# EAGLE design ee242a-lab6-amp-osc (EAGLE 9.2.2)

## Sheet 1 of 2
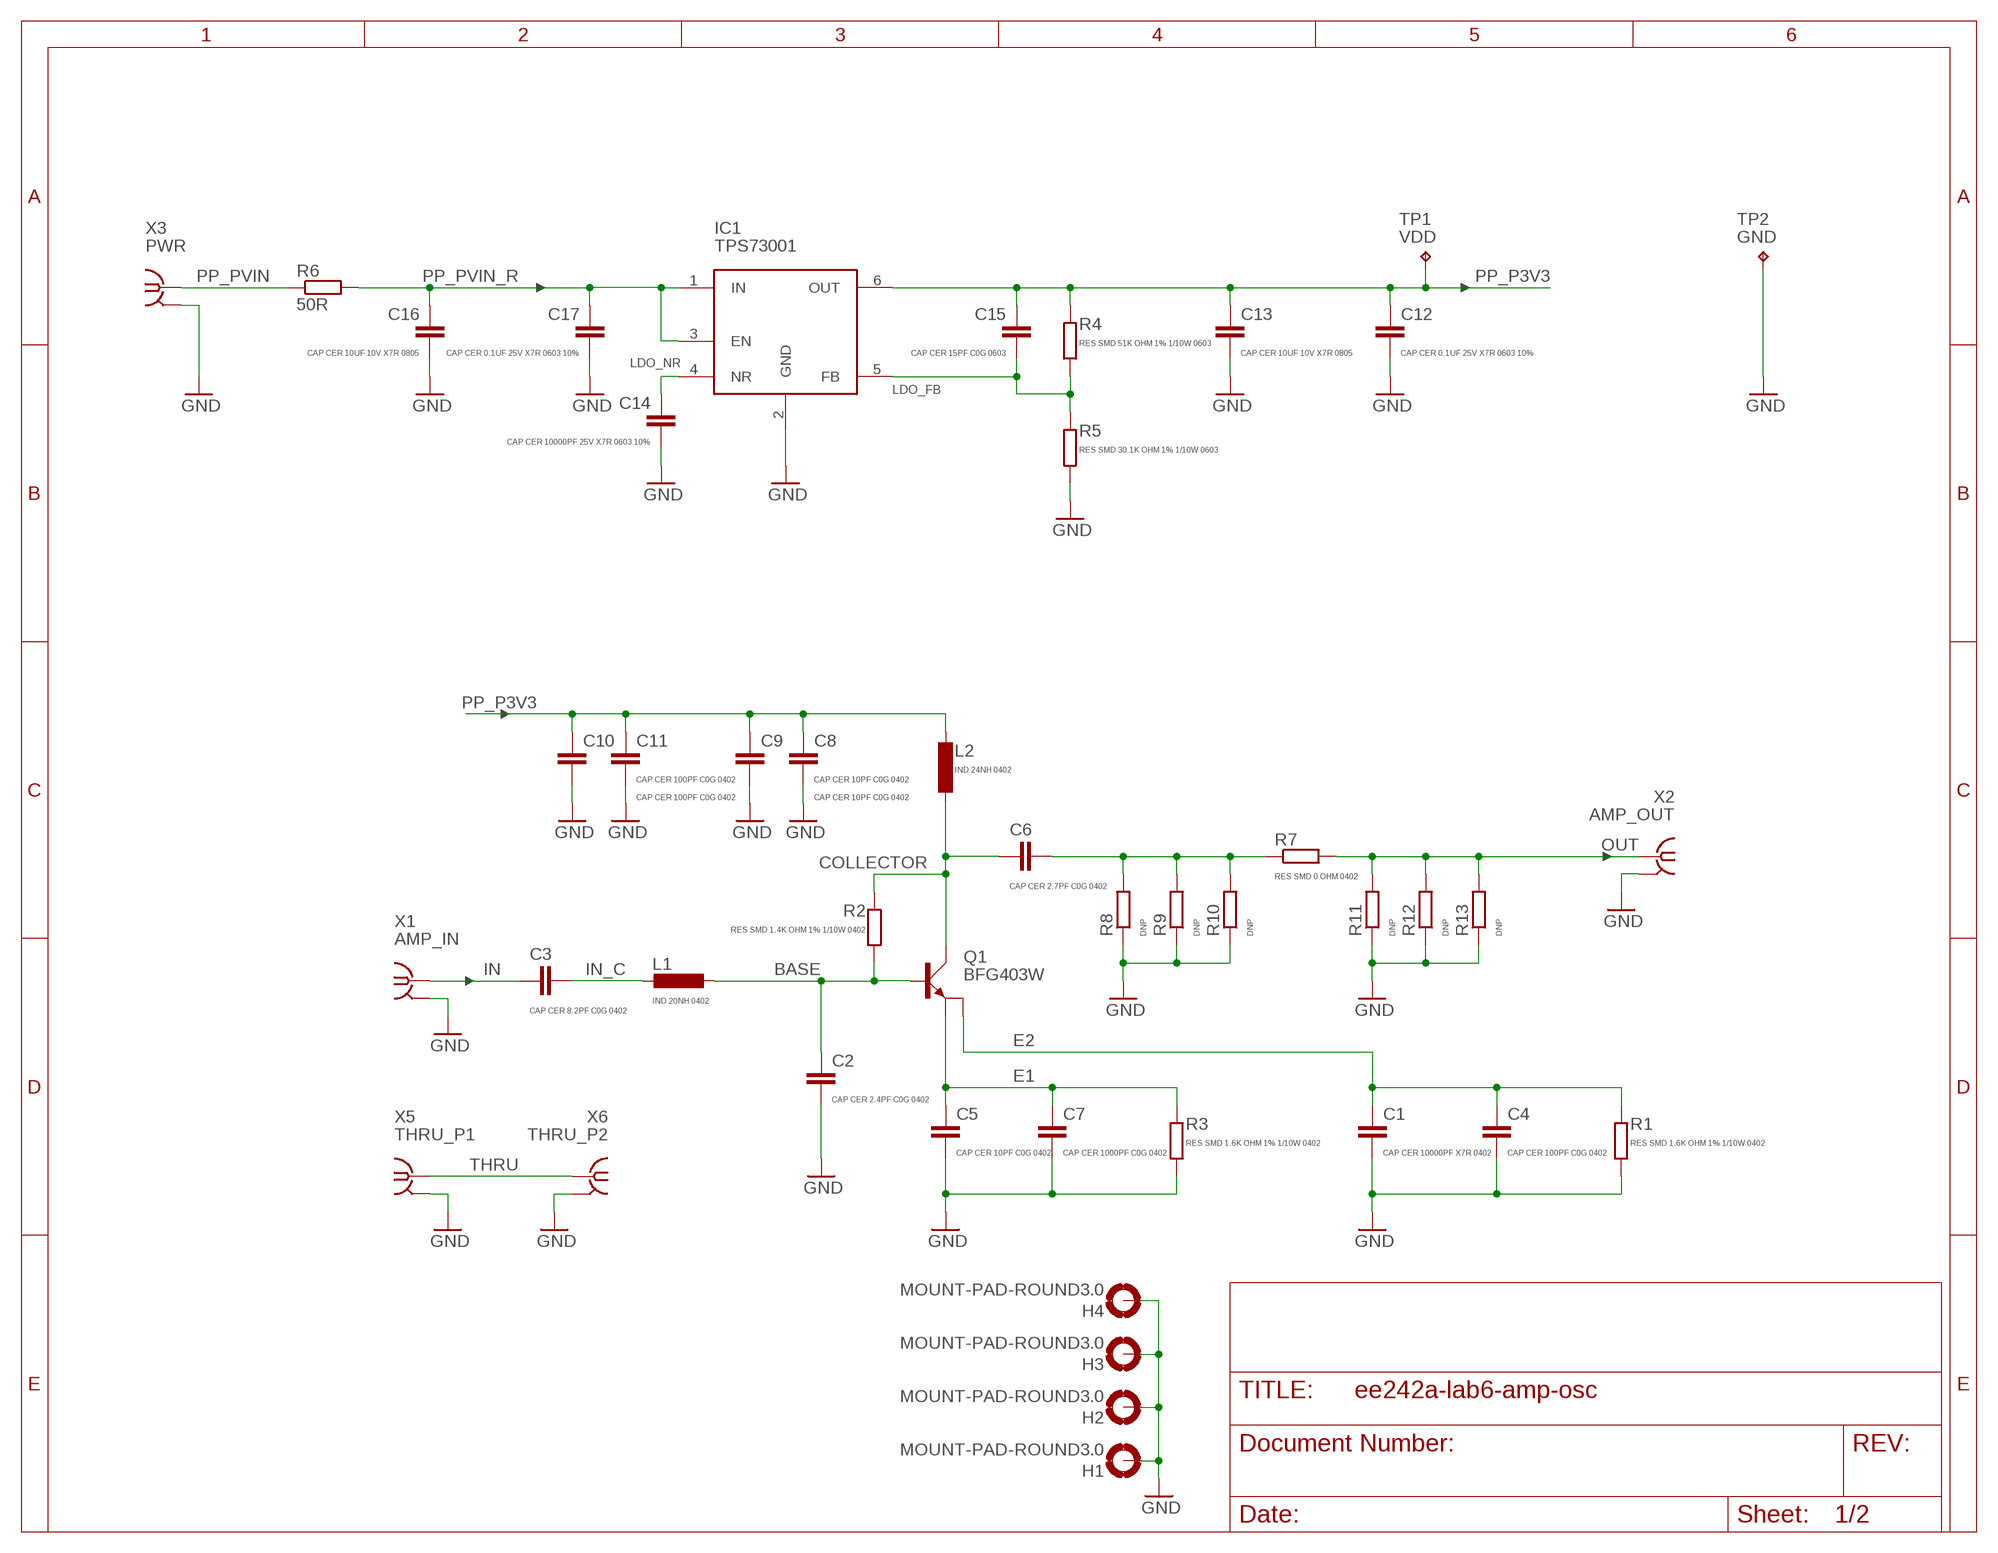
[diagram p0: schematic, sheet 1]

### Parts
C1  CAP CER 10000PF X7R 0402  C-EUC0402  [C0402]
C2  CAP CER 2.4PF C0G 0402  C-EUC0402  [C0402]
C3  CAP CER 8.2PF C0G 0402  C-EUC0402  [C0402]
C4  CAP CER 100PF C0G 0402  C-EUC0402  [C0402]
C5  CAP CER 10PF C0G 0402  C-EUC0402  [C0402]
C6  CAP CER 2.7PF C0G 0402  C-EUC0402  [C0402]
C7  CAP CER 1000PF C0G 0402  C-EUC0402  [C0402]
C8  CAP CER 10PF C0G 0402  C-EUC0402  [C0402]
C9  CAP CER 10PF C0G 0402  C-EUC0402  [C0402]
C10  CAP CER 100PF C0G 0402  C-EUC0402  [C0402]
C11  CAP CER 100PF C0G 0402  C-EUC0402  [C0402]
C12  CAP CER 0.1UF 25V X7R 0603 10%  C-EUC0603  [C0603]
C13  CAP CER 10UF 10V X7R 0805  C-EUC0805  [C0805]
C14  CAP CER 10000PF 25V X7R 0603 10%  C-EUC0603  [C0603]
C15  CAP CER 15PF C0G 0603  C-EUC0603  [C0603]
C16  CAP CER 10UF 10V X7R 0805  C-EUC0805  [C0805]
C17  CAP CER 0.1UF 25V X7R 0603 10%  C-EUC0603  [C0603]
H1  MOUNT-PAD-ROUND3.0  [3,0-PAD]
H2  MOUNT-PAD-ROUND3.0  [3,0-PAD]
H3  MOUNT-PAD-ROUND3.0  [3,0-PAD]
H4  MOUNT-PAD-ROUND3.0  [3,0-PAD]
IC1  TPS73001  [SOT23-6L]
L1  IND 20NH 0402  L-EU0402  [R0402]
L2  IND 24NH 0402  L-EU0402  [R0402]
Q1  BFG403W  [SOT343R]
R1  RES SMD 1.6K OHM 1% 1/10W 0402  R-EU_R0402  [R0402]
R2  RES SMD 1.4K OHM 1% 1/10W 0402  R-EU_R0402  [R0402]
R3  RES SMD 1.6K OHM 1% 1/10W 0402  R-EU_R0402  [R0402]
R4  RES SMD 51K OHM 1% 1/10W 0603  R-EU_R0603  [R0603]
R5  RES SMD 30.1K OHM 1% 1/10W 0603  R-EU_R0603  [R0603]
R6  50R  R-EU_R0805  [R0805]
R7  RES SMD 0 OHM 0402  R-EU_R0402  [R0402]
R8  DNP  R-EU_R0402  [R0402]
R9  DNP  R-EU_R0402  [R0402]
R10  DNP  R-EU_R0402  [R0402]
R11  DNP  R-EU_R0402  [R0402]
R12  DNP  R-EU_R0402  [R0402]
R13  DNP  R-EU_R0402  [R0402]
TP1  VDD  KEYSTONE_5000  [KEYSTONE_5000_MINIATURE]
TP2  GND  KEYSTONE_5000  [KEYSTONE_5000_MINIATURE]
X1  AMP_IN  SMA-142-0701-881/886  [J502-ND-142-0701-881/886]
X2  AMP_OUT  SMA-142-0701-881/886  [J502-ND-142-0701-881/886]
X3  PWR  SMA-142-0701-881/886  [J502-ND-142-0701-881/886]
X5  THRU_P1  SMA-142-0701-881/886  [J502-ND-142-0701-881/886]
X6  THRU_P2  SMA-142-0701-881/886  [J502-ND-142-0701-881/886]

### Nets
BASE: C2.1 L1.2 Q1.2(B) R2.2
COLLECTOR: C6.1 L2.2 Q1.4(C) R2.1
E1: C5.1 C7.1 Q1.1(E1) R3.1
E2: C1.1 C4.1 Q1.3(E2) R1.1
GND: C1.2 C2.2 C4.2 C5.2 C7.2 C8.2 C9.2 C10.2 C11.2 C12.2 C13.2 C14.2 C16.2 C17.2 H1.B3,0(MOUNT) H2.B3,0(MOUNT) H3.B3,0(MOUNT) H4.B3,0(MOUNT) IC1.2(GND) R1.2 R3.2 R5.2 R8.1 R9.1 R10.1 R11.1 R12.1 R13.1 TP2.P$1 X1.G@1(GND) X2.G@1(GND) X3.G@1(GND) X5.G@1(GND) X6.G@1(GND) ; also sheet 2
IN: C3.1 X1.1
IN_C: C3.2 L1.1
LDO_FB: C15.2 IC1.5(FB) R4.1 R5.1
LDO_NR: C14.1 IC1.4(NR)
N$1: C6.2 R7.1 R8.2 R9.2 R10.2
OUT: R7.2 R11.2 R12.2 R13.2 X2.1
PP_P3V3: C8.1 C9.1 C10.1 C11.1 C12.1 C13.1 C15.1 IC1.6(OUT) L2.1 R4.2 TP1.P$1
PP_PVIN: R6.1 X3.1
PP_PVIN_R: C16.1 C17.1 IC1.1(IN) IC1.3(EN) R6.2
THRU: X5.1 X6.1

## Sheet 2 of 2
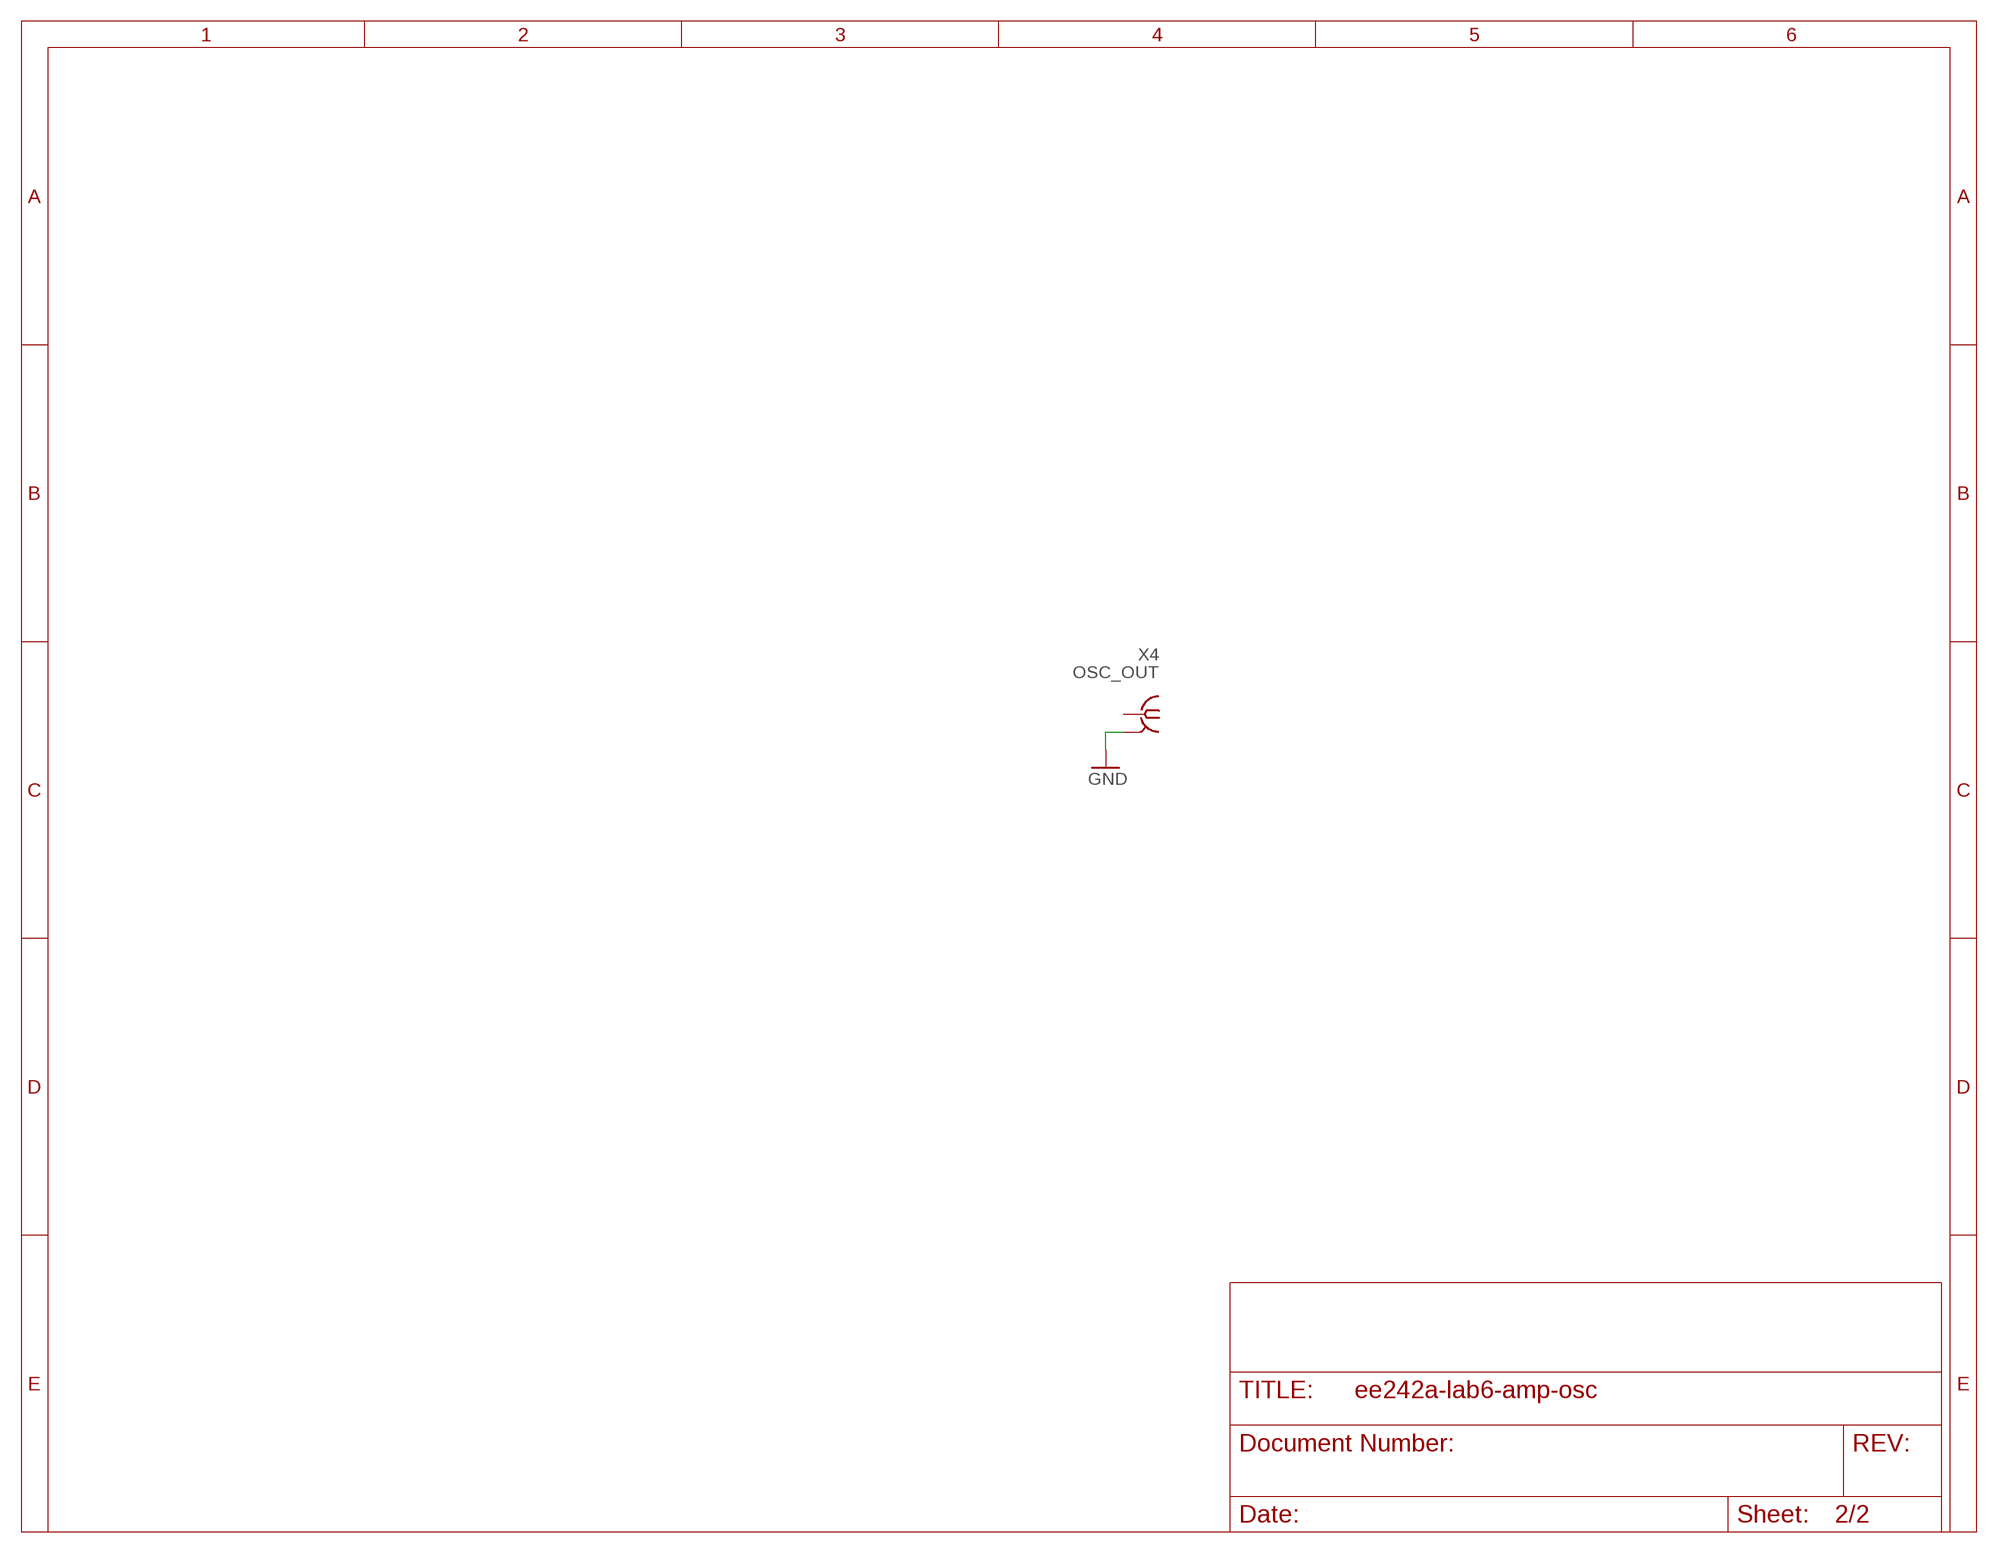
[diagram p1: schematic, sheet 2]

### Parts
X4  OSC_OUT  SMA-142-0701-881/886  [J502-ND-142-0701-881/886]

### Nets
GND: X4.G@1(GND) ; also sheet 1
Unconnected: X4.1

## Power pins joined to a net without a drawn wire
GND: X1.G@2(GND) X1.G@3(GND) X1.G@4(GND) X2.G@2(GND) X2.G@3(GND) X2.G@4(GND) X3.G@2(GND) X3.G@3(GND) X3.G@4(GND) X4.G@2(GND) X4.G@3(GND) X4.G@4(GND) X5.G@2(GND) X5.G@3(GND) X5.G@4(GND) X6.G@2(GND) X6.G@3(GND) X6.G@4(GND)

## Library data of the parts
C1-C12 C14 C15 C17 = rcl-modified-footprints:C-EU: CAPACITOR, European symbol
C13 C16 = rcl:C-EU: CAPACITOR, European symbol
H1-H4 = holes:MOUNT-PAD-ROUND: MOUNTING PAD, round
IC1 = ee242a-lab-components:TPS73001
L1 L2 = rcl-modified-footprints:L-EU: INDUCTOR, European symbol
Q1 = ee242a-lab-components:BFG403W
R1-R13 = rcl-modified-footprints:R-EU_: RESISTOR, European symbol
TP1 TP2 = ee242a-lab-components:KEYSTONE_5000
X1-X6 = ee242a-lab-components:SMA-: SMA 50 Ohm End Launch Jack Receptacle - Round Contact Johnson Components Source: www.johnsoncomponents.com .. J502-ND.pdf; MF: JOHNSON COMPONENTS; MPN: 142-0701-881; OC_FARNELL: 1608603; OC_NEWARK: 08B906

## Board
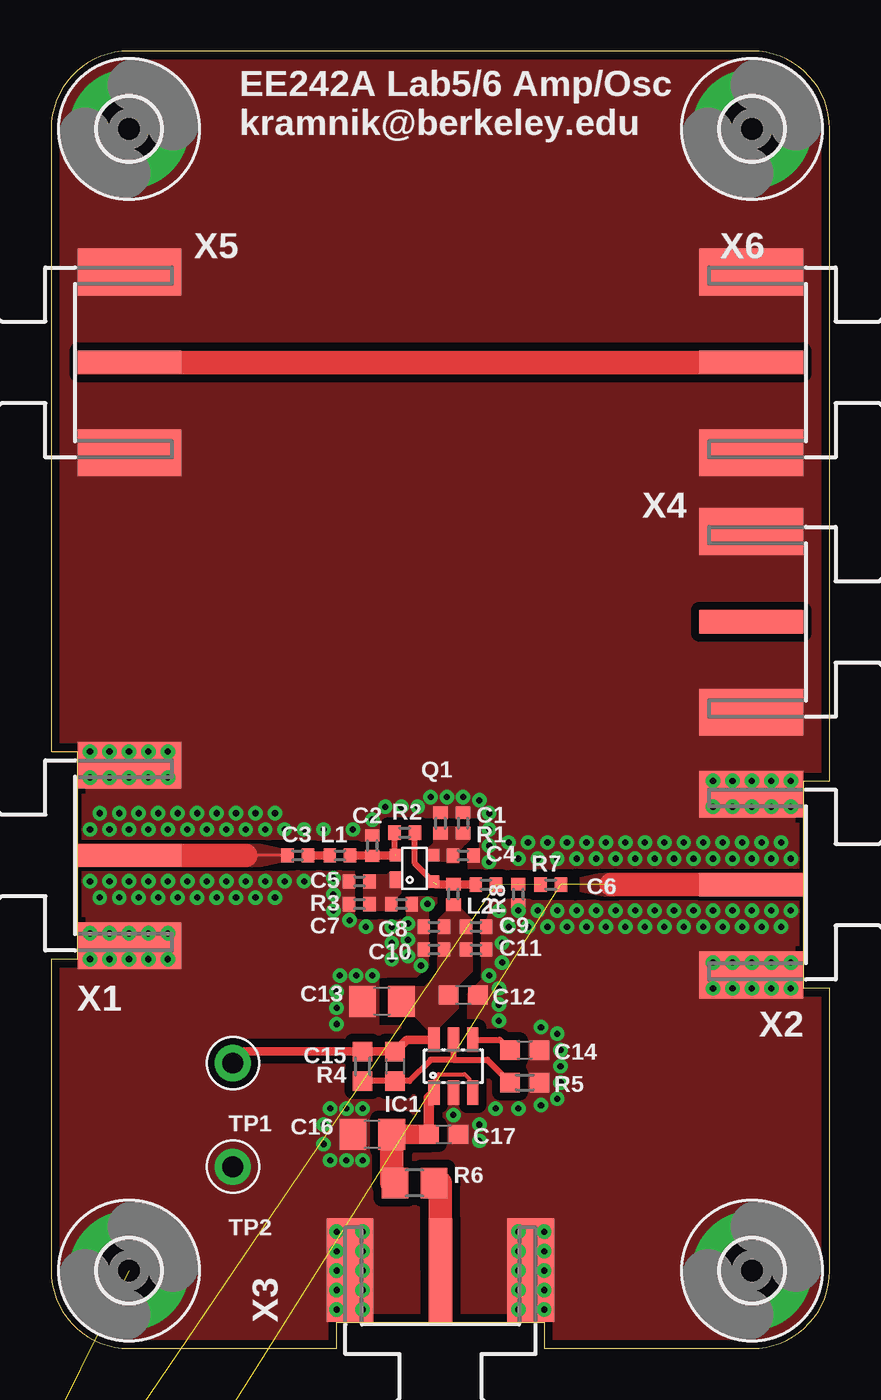
[diagram p2: board, top side]
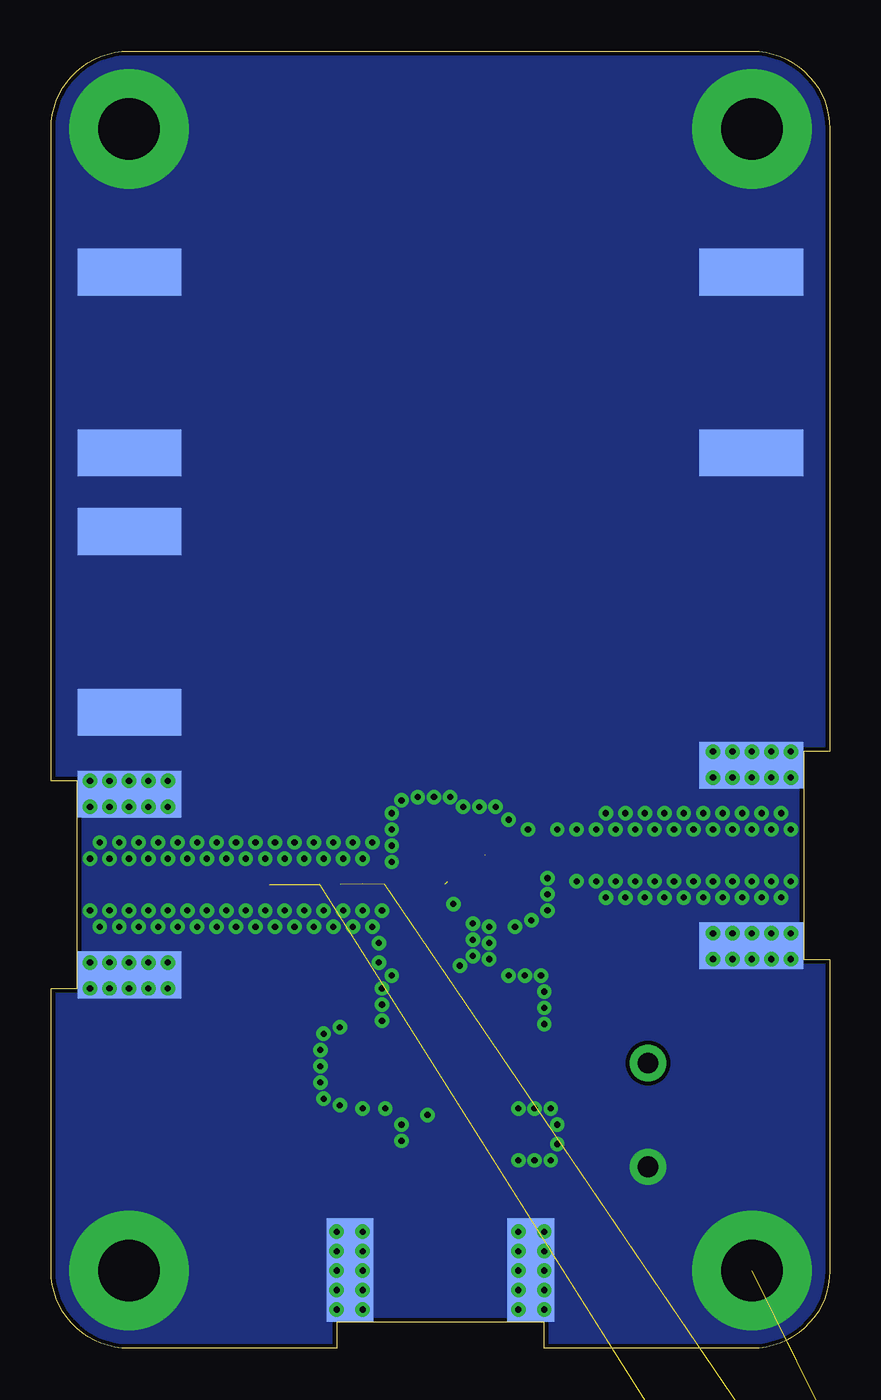
[diagram p3: board, bottom side, seen from below]

Size 38.1 x 63.5 mm. Coordinates in mm from the lower left corner, seen from the top.
Outline: 0,19.05 0,3.81 arc90 3.81,0 13.97,0 13.97,1.27 24.13,1.27 24.13,0 34.29,0 arc90 38.1,3.81 38.1,17.62 36.83,17.62 36.83,27.78 38.1,27.78 38.1,59.69 arc90 34.29,63.5 3.81,63.5 arc90 0,59.69 0,29.21 1.27,29.21 1.27,19.05 0,19.05
Copper layers (1*16): Top 0.035mm / dielectric 1.5mm / Bottom 0.035mm
Design rules "default *": minimum track width 6mil, minimum drill 0.3mm, track to track 8mil, track to pad 8mil, pad to pad 8mil, via to via 8mil, smd to smd 0mil, copper to edge 8mil, drill to drill 8mil, minimum pad ring 10mil, minimum via ring 8mil, stop-mask expansion 3mil, vias tented up to drill 0.5mm, thermal gap 10mil
tRestrict: 2 lines

### Footprints (pad centres in the part's own frame; a part is rotated, then mirrored left to right if it is on the bottom)
C0402 = smd 0.6 x 0.7: 1 -0.5,0; 2 0.5,0
C0603 = smd 0.95 x 0.95: 1 -0.725,0; 2 0.725,0
C0805 = smd 1.3 x 1.5: 1 -0.95,0; 2 0.95,0
3,0-PAD = drill 3 pad 5.842: B3,0 0,0
SOT23-6L = smd 0.55 x 1.2: 1 -0.95,-1.3; 2 0,-1.3; 3 0.95,-1.3; 4 0.95,1.3; 5 0,1.3; 6 -0.95,1.3
R0402 = smd 0.6 x 0.7: 1 -0.5,0; 2 0.5,0
SOT343R = smd 0.55 x 0.8: 1 -0.925,-0.55 | smd 0.55 x 0.6: 2 -0.925,0.65; 3 0.925,0.65; 4 0.925,-0.65
R0603 = smd 0.95 x 0.95: 1 -0.725,0; 2 0.725,0
R0805 = smd 1.3 x 1.5: 1 -0.95,0; 2 0.95,0
KEYSTONE_5000_MINIATURE = drill 1.016 pad 1.778: P$1 0,0
J502-ND-142-0701-881/886 = smd 5.08 x 1.143: 1 2.565,0 | smd 5.08 x 2.286: G@1 2.565,4.42; G@2 2.565,-4.42 | smd 5.08 x 2.286 bottom: G@3 2.565,4.42; G@4 2.565,-4.42

### Placement (x,y rotation side)
C1  19.05,25.72 90 top
C2  15.72,24.61 90 top
C3  12.06,24.13 0 top
C4  20.16,24.13 0 top
C5  15.08,22.86 180 top
C6  21.27,22.7 0 top
C7  17.14,21.75 0 top
C8  18.73,20.64 180 top
C9  20.8,20.64 0 top
C10  18.73,19.53 180 top
C11  20.8,19.53 0 top
C12  20.16,17.3 0 top
C13  16.19,16.99 180 top
C14  23.18,14.61 0 top
C15  16.83,13.81 270 top
C16  15.72,10.48 180 top
C17  19.21,10.48 0 top
H1  3.81,59.69 0 top
H2  34.29,59.69 0 top
H3  3.81,3.81 0 top
H4  34.29,3.81 0 top
IC1  19.68,13.81 0 top
L1  14.13,24.13 0 top
L2  19.68,22.23 90 top
Q1  17.78,23.5 0 top
R1  20.16,25.72 90 top
R2  17.3,25.24 180 top
R3  15.08,21.75 180 top
R4  15.24,13.81 90 top
R5  23.18,13.02 0 top
R6  17.78,8.1 180 top
R7  24.45,22.7 0 top
R8  22.86,22.23 90 top
R9  -6.67,-18.41 0 top  (outside the outline)
R10  -6.67,-22.54 0 top  (outside the outline)
R11  -6.67,-26.67 0 top  (outside the outline)
R12  -6.67,-30.8 0 top  (outside the outline)
R13  -6.67,-34.92 0 top  (outside the outline)
TP1  8.89,13.97 180 top
TP2  8.89,8.89 180 top
X1  1.27,24.13 0 top
X2  36.83,22.7 180 top
X3  19.05,1.27 90 top
X4  36.83,35.56 180 top
X5  1.27,48.26 0 top
X6  36.83,48.26 180 top

### Tracks (layer width: path | path; a pad name or v marks a point on that pad's centre or on a via)
BASE  (1 unrouted)
  Top 0.305: 16.86,25.24 R2.2 16.8,24.2 Q1.2
  Top 0.406: L1.2 15.72,24.13 | 15.72,24.13 Q1.2 | C2.1 15.72,24.13
COLLECTOR  (1 unrouted)
  Top 0.305: Q1.4 17.8,23.75 R2.1
  Top 0.406: C6.1 19.68,22.7 | 19.68,22.7 18.85,22.7 | L2.2 19.68,22.7
E1
  pour Top (no thermals): 15.29,23.2 16.45,23.2 16.59,23.34 17.12,23.34 17.12,22.28 16.94,22.09 16.94,21.41 15.29,21.41
E2
  pour Top (no thermals): 18.44,23.85 19.28,23.85 19.35,23.77 19.96,23.77 19.96,24.38 20.52,24.94 20.52,25.53 18.69,25.53 18.69,24.71 18.44,24.46
GND  (via drill 0.3)  (5 unrouted)
  other vias: 21.91,21.43 22.07,19.84 24.92,13.02 24.92,13.81 23.97,11.91 24.92,14.61 19.68,11.43 18.41,21.75 17.46,20 17.46,19.21 18.1,18.73 17.46,20.8 13.81,23.02 13.81,22.23 21.43,23.81 18.57,26.99 17.94,26.51 14.76,25.4 15.72,25.88 17.14,26.51 16.35,26.51 16.67,20.64 15.4,20.64 14.61,20.95 13.81,21.43 20.16,26.99 20.95,26.83 24.77,12.22 23.97,15.72 24.77,15.4 20.95,10.95 20.95,10.16 21.75,11.75 22.86,11.75 15.24,11.75 14.45,11.75 13.65,11.75 13.34,10.95 13.34,10 15.24,9.21 14.45,9.21 13.65,9.21 15.72,18.26 14.92,18.26 14.13,18.26 13.97,17.46 13.97,16.67 13.97,15.88 21.43,18.26 21.91,17.62 21.91,16.83 21.91,16.03 21.43,24.61 21.43,25.4 19.37,26.99 22.07,18.89 1.91,22.86 2.86,22.86 3.81,22.86 4.76,22.86 5.71,22.86 6.67,22.86 7.62,22.86 8.57,22.86 9.53,22.86 10.48,22.86 11.43,22.86 12.38,22.86 1.91,25.4 2.86,25.4 3.81,25.4 4.76,25.4 5.71,25.4 6.67,25.4 7.62,25.4 8.57,25.4 9.53,25.4 10.48,25.4 11.43,25.4 12.38,25.4 13.34,25.4 2.38,26.19 3.33,26.19 4.29,26.19 5.24,26.19 6.19,26.19 7.14,26.19 8.1,26.19 9.05,26.19 10,26.19 10.95,26.19 2.38,22.07 3.33,22.07 4.29,22.07 5.24,22.07 6.19,22.07 7.14,22.07 8.1,22.07 9.05,22.07 10,22.07 10.95,22.07 27.15,24.77 28.1,24.77 29.05,24.77 30,24.77 30.96,24.77 31.91,24.77 32.86,24.77 33.81,24.77 34.77,24.77 35.72,24.77 36.2,26.51 32.38,26.51 32.38,27.78 36.2,27.78 34.29,27.78 34.29,26.51 27.62,23.97 28.57,23.97 29.53,23.97 30.48,23.97 31.43,23.97 32.38,23.97 33.34,23.97 34.29,23.97 35.24,23.97 36.2,23.97 26.67,23.97 25.72,23.97 24.77,23.97 23.81,23.97 22.86,23.97 26.19,24.77 25.24,24.77 24.29,24.77 23.34,24.77 27.15,20.64 28.1,20.64 29.05,20.64 30,20.64 30.96,20.64 31.91,20.64 32.86,20.64 33.81,20.64 34.77,20.64 35.72,20.64 27.62,21.43 28.57,21.43 29.53,21.43 30.48,21.43 31.43,21.43 32.38,21.43 33.34,21.43 34.29,21.43 35.24,21.43 36.2,21.43 26.67,21.43 25.72,21.43 24.77,21.43 26.19,20.64 25.24,20.64 23.81,21.43 24.29,20.64 22.86,21.43 23.34,20.64 35.24,26.51 35.24,27.78 33.34,27.78 33.34,26.51 36.2,17.62 32.38,17.62 32.38,18.89 36.2,18.89 34.29,18.89 34.29,17.62 35.24,17.62 35.24,18.89 33.34,18.89 33.34,17.62 5.71,27.94 1.91,27.94 1.91,29.21 5.71,29.21 3.81,29.21 3.81,27.94 4.76,27.94 4.76,29.21 2.86,29.21 2.86,27.94 5.71,19.05 1.91,19.05 1.91,20.32 5.71,20.32 3.81,20.32 3.81,19.05 4.76,19.05 4.76,20.32 2.86,20.32 2.86,19.05 21.43,26.19 15.24,5.71 15.24,1.91 13.97,1.91 13.97,5.71 13.97,3.81 15.24,3.81 15.24,4.76 13.97,4.76 13.97,2.86 15.24,2.86 24.13,5.71 24.13,1.91 22.86,1.91 22.86,5.71 22.86,3.81 24.13,3.81 24.13,4.76 22.86,4.76 22.86,2.86 24.13,2.86 16.67,19.05 16.67,19.84 22.38,20.64 22.38,24.77
  pour Bottom (no thermals): 0,0 0,63.5 38.1,63.5 38.1,0
  pour Top (isolate 0.406, rank 6, no thermals): 0,0 0,63.5 38.1,63.5 38.1,0
  pour Top (rank 2): 1.27,29.21 11.59,29.21 11.59,24.92 1.43,24.61 1.43,23.65 11.59,23.34 11.59,19.05 1.27,19.05
  pour Top (rank 2): 36.83,17.62 25.24,17.62 25.24,21.91 31.59,22.23 31.59,23.3 25.24,23.5 25.24,27.78 36.83,27.78
IN
  Top 0.152: C3.1 9.53,24.13
  Top 1.143: 9.53,24.13 X1.1
  pour Top (no thermals): 9.58,23.58 9.98,23.58 arc12 10.51,23.64 11.29,23.81 11.29,24.45 10.51,24.62 arc12 9.98,24.68 9.58,24.68
IN_C
  Top 0.406: C3.2 L1.1
LDO_FB
  Top 0.305: R4.1 C15.2 17.53,13.09 18.57,14.13 19.68,14.13 | IC1.5 19.68,14.13 | 19.68,14.13 21.34,14.13 R5.1
LDO_NR
  Top 0.305: IC1.4 21.95,15.11 C14.1
N$1  (4 unrouted)
OUT  (4 unrouted)
  Top 1.143: X2.1 27.42,22.7
  pour Top (no thermals): 27.57,23.25 27.17,23.25 arc12 26.64,23.19 25.86,23.03 25.86,22.38 26.64,22.21 arc12 27.17,22.16 27.57,22.16
PP_P3V3
  Top 0.406: TP1.P$1 9.46,14.54 R4.2 C15.1 17.4,15.11 IC1.6
  pour Top (no thermals): 19.33,22.02 20.04,22.02 20.04,21.54 20.6,20.98 20.6,18.47 19.91,17.78 19.91,16.64 19,15.72 19,14.5 18.47,14.5 18.47,15.57 17.81,16.23 16.48,16.23 16.48,17.73 18.29,17.73 18.92,18.36 18.92,20.98 19.33,21.39
PP_PVIN
  Top 1.143: X3.1 19.05,8.1 R6.1
PP_PVIN_R
  Top 0.203: IC1.3 20.48,12.67 20.48,13.18 20.24,13.42 18.97,13.42 18.79,13.24 18.79,12.56 IC1.1
  Top 0.508: IC1.1 18.48,12.26 C17.1
  Top 0.965: C17.1 C16.1
  Top 1.143: C16.1 16.67,8.1 R6.2
THRU
  Top 1.143: X6.1 X5.1

### Text on the board
tPlace: EE242A Lab5/6 Amp/Osc / kramnik@berkeley.edu